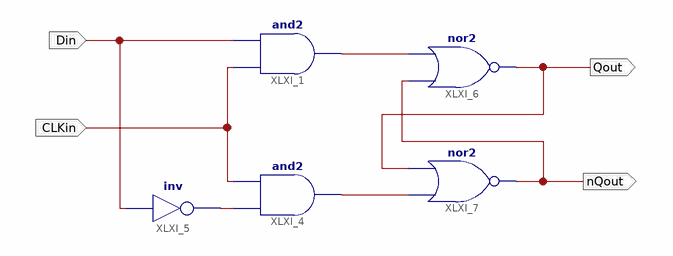
[diagram p0: schematic sheet 1]
// Xilinx ISE schematic Lab7Exp4.sch (spartan3e) as structural Verilog: 5 symbols, 4 ports
module Lab7Exp4 (
  input  CLKin,
  input  Din,
  output Qout,
  output nQout
);

  wire XLXN_1, XLXN_10, XLXN_11;

  and XLXI_1 (XLXN_10, CLKin, Din);
  and XLXI_4 (XLXN_11, XLXN_1, CLKin);
  not XLXI_5 (XLXN_1, Din);
  nor XLXI_6 (Qout, nQout, XLXN_10);
  nor XLXI_7 (nQout, XLXN_11, Qout);
endmodule
